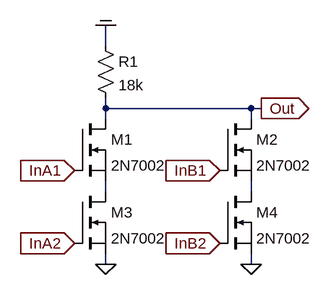
[diagram p0: schematic nm_aoi2x2.asc]
nm_aoi2x2.asc, the LTspice schematic file:
Version 4
SHEET 1 1092 680
WIRE 224 32 224 0
WIRE 224 128 224 112
WIRE 448 128 224 128
WIRE 464 128 448 128
WIRE 224 144 224 128
WIRE 448 144 448 128
WIRE 224 256 224 240
WIRE 448 256 448 240
WIRE 224 368 224 352
WIRE 448 368 448 352
FLAG 176 224 InA1
IOPIN 176 224 In
FLAG 464 128 Out
IOPIN 464 128 Out
FLAG 224 0 COM
FLAG 448 368 0
FLAG 400 224 InB1
IOPIN 400 224 In
FLAG 224 368 0
FLAG 176 336 InA2
IOPIN 176 336 In
FLAG 400 336 InB2
IOPIN 400 336 In
SYMBOL nmos 176 144 R0
SYMATTR InstName M1
SYMATTR Value 2N7002
SYMBOL res 208 16 R0
SYMATTR InstName R1
SYMATTR Value 18k
SYMBOL nmos 400 144 R0
SYMATTR InstName M2
SYMATTR Value 2N7002
SYMBOL nmos 176 256 R0
SYMATTR InstName M3
SYMATTR Value 2N7002
SYMBOL nmos 400 256 R0
SYMATTR InstName M4
SYMATTR Value 2N7002

The netlist it stands for:
* nm_aoi2x2.asc
M1 Out InA1 N001 N001 2N7002
R1 COM Out 18k
M2 Out InB1 N002 N002 2N7002
M3 N001 InA2 0 0 2N7002
M4 N002 InB2 0 0 2N7002
.model NMOS NMOS
.model PMOS PMOS
.lib standard.mos
.backanno
.end